# EAGLE design skin_orch (EAGLE 7.3.0)
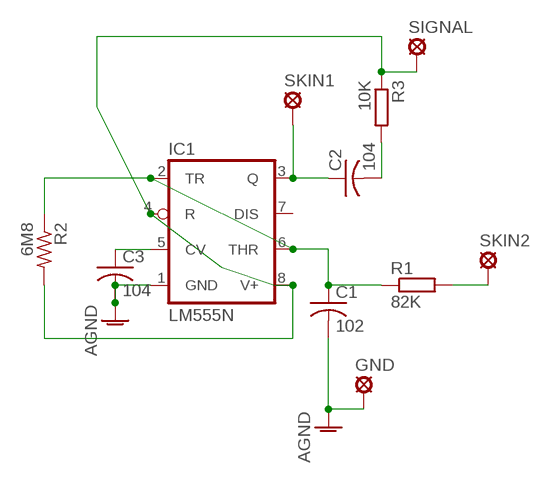
[diagram p0: schematic, sheet 1]

## Parts
C1  102  C-US025-030X050  [C025-030X050]
C2  104  C-US025-030X050  [C025-030X050]
C3  104  C-US025-030X050  [C025-030X050]
GND  LSP10  [LSP10]
IC1  LM555N  [DIL08]
R1  82K  R-EU_0207/2V  [0207/2V]
R2  6M8  R-US_0207/7  [0207/7]
R3  10K  R-EU_0207/2V  [0207/2V]
SIGNAL  LSP10  [LSP10]
SKIN1  LSP10  [LSP10]
SKIN2  LSP10  [LSP10]

## Nets
AGND: C1.2 C3.2 GND.MP IC1.1(GND)
N$2: R1.2 SKIN2.MP
N$3: C3.1 IC1.5(CV)
N$4: IC1.4(R) IC1.8(V+) R2.2 R3.1 SIGNAL.MP
N$5: C2.1 IC1.3(Q) SKIN1.MP
N$6: C2.2 R3.2
N$9: C1.1 IC1.2(TR) IC1.6(THR) R1.1 R2.1
Unconnected: IC1.7(DIS)

## Library data of the parts
C1-C3 = resistor:C-US: CAPACITOR, American symbol
GND SIGNAL SKIN1 SKIN2 = solpad:LSP10: SOLDER PAD drill 1.0 mm, distributor Buerklin, 12H555
IC1 = linear:*555: TIMER
R1 R3 = resistor:R-EU_: RESISTOR, European symbol
R2 = resistor:R-US_: RESISTOR, American symbol

## Net classes
0 default: clearance 0.205 mm

## Board
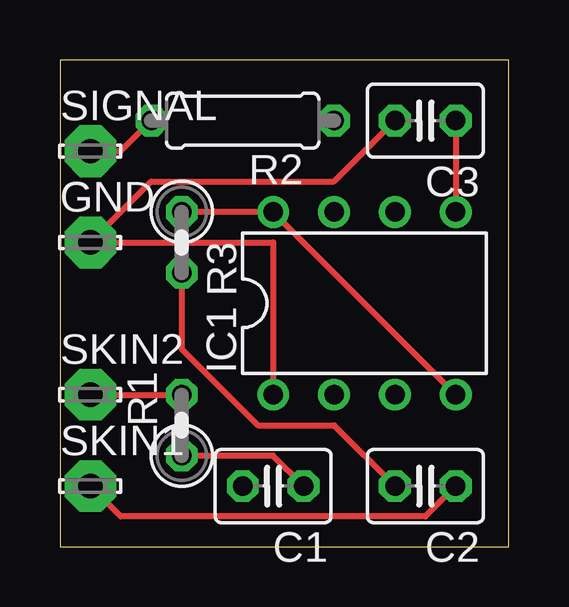
[diagram p1: board, top side]
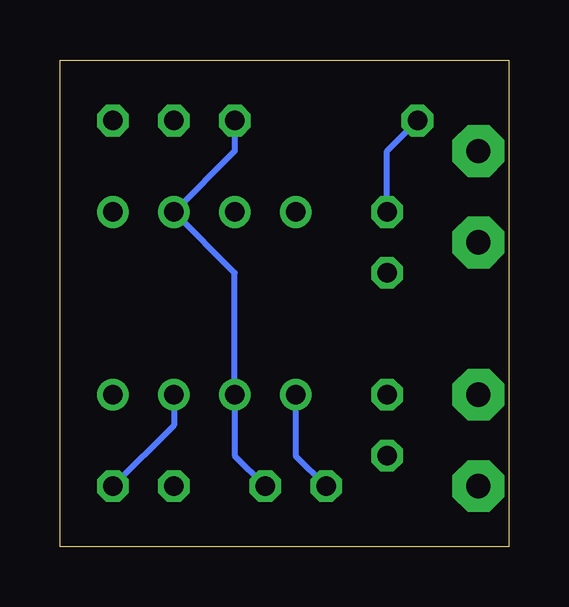
[diagram p2: board, bottom side, seen from below]

Size 18.72 x 20.31 mm. Coordinates in mm from the lower left corner, seen from the top.
Outline: 0,0 18.72,0 18.72,20.31 0,20.31 0,0
Copper layers (1*16): Top 0.035mm / dielectric 1.5mm / Bottom 0.035mm
Design rules "default": minimum track width 10mil, minimum drill 24mil, track to track 8mil, track to pad 8mil, pad to pad 8mil, via to via 8mil, smd to smd 8mil, copper to edge 40mil, drill to drill 8mil, minimum pad ring 10mil, minimum via ring 8mil, stop-mask expansion 4mil, vias tented up to drill 0mil, thermal gap 10mil

### Footprints (pad centres in the part's own frame; a part is rotated, then mirrored left to right if it is on the bottom)
C025-030X050 = drill 0.813 octagon: 1 -1.27,0; 2 1.27,0
LSP10 = drill 1.016 pad 2.159 octagon: MP 0,0
DIL08 = drill 0.813 pad 1.27: 1 -3.81,-3.81; 2 -1.27,-3.81; 3 1.27,-3.81; 4 3.81,-3.81; 5 3.81,3.81; 6 1.27,3.81; 7 -1.27,3.81; 8 -3.81,3.81
0207/2V = drill 0.813 octagon: 1 -1.27,0; 2 1.27,0
0207/7 = drill 0.813 octagon: 1 -3.81,0; 2 3.81,0

### Placement (x,y rotation side)
C1  8.89,2.54 180 top
C2  15.24,2.54 180 top
C3  15.24,17.78 180 top
GND  1.27,12.7 0 top
IC1  12.7,10.16 0 top
R1  5.08,5.08 90 top
R2  7.62,17.78 180 top
R3  5.08,12.7 270 top
SIGNAL  1.27,16.51 0 top
SKIN1  1.27,2.54 0 top
SKIN2  1.27,6.35 0 top

### Tracks (layer width: path | path; a pad name or v marks a point on that pad's centre or on a via)
AGND
  Top 0.254: C3.2 11.43,15.24 3.81,15.24 GND.MP 8.89,12.7 IC1.1
  Bottom 0.254: C1.2 8.89,3.81 IC1.1
N$2
  Top 0.254: SKIN2.MP R1.2
N$3
  Top 0.254: C3.1 IC1.5
N$4
  Top 0.254: R2.2 2.54,16.51 SIGNAL.MP | R3.1 IC1.8 IC1.4
  Bottom 0.254: R2.2 5.08,16.51 R3.1
N$5
  Top 0.254: SKIN1.MP 2.54,1.27 15.24,1.27 C2.1
  Bottom 0.254: C2.1 13.97,5.08 IC1.3
N$6
  Top 0.254: C2.2 11.43,5.08 8.25,5.08 5.08,8.25 R3.2
N$9
  Top 0.254: R1.1 8.89,3.81 C1.1
  Bottom 0.254: R2.1 11.43,16.51 IC1.6 11.43,11.43 IC1.2 11.43,3.81 C1.1